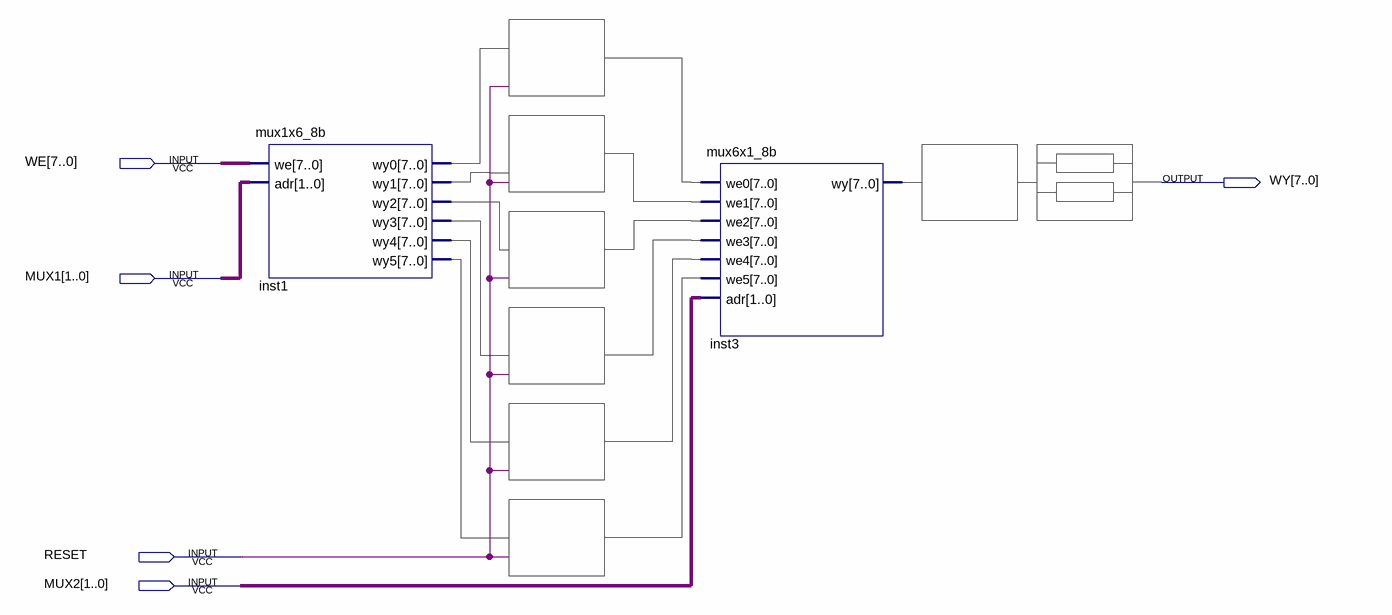
[diagram p0: schematic sheet]
// Quartus schematic Stos.bdf as structural Verilog: 2 symbols, 5 pins
module Stos (
  input  [7:0] WE,
  input  [1:0] MUX1,
  input  RESET,
  input  [1:0] MUX2,
  output [7:0] WY
);

  mux1x6_8b inst1 (.we(WE), .adr(MUX1));  // open: wy0, wy1, wy2, wy3, wy4, wy5
  mux6x1_8b inst3 (.adr(MUX2));  // open: we0, we1, we2, we3, we4, we5, wy
endmodule
